# EasyEDA schematic dev_kit.json
TITLE: Sheet_1; REV: 1.0; Date: 2024-11-02; Sheet: 1/1; Company: Your Company
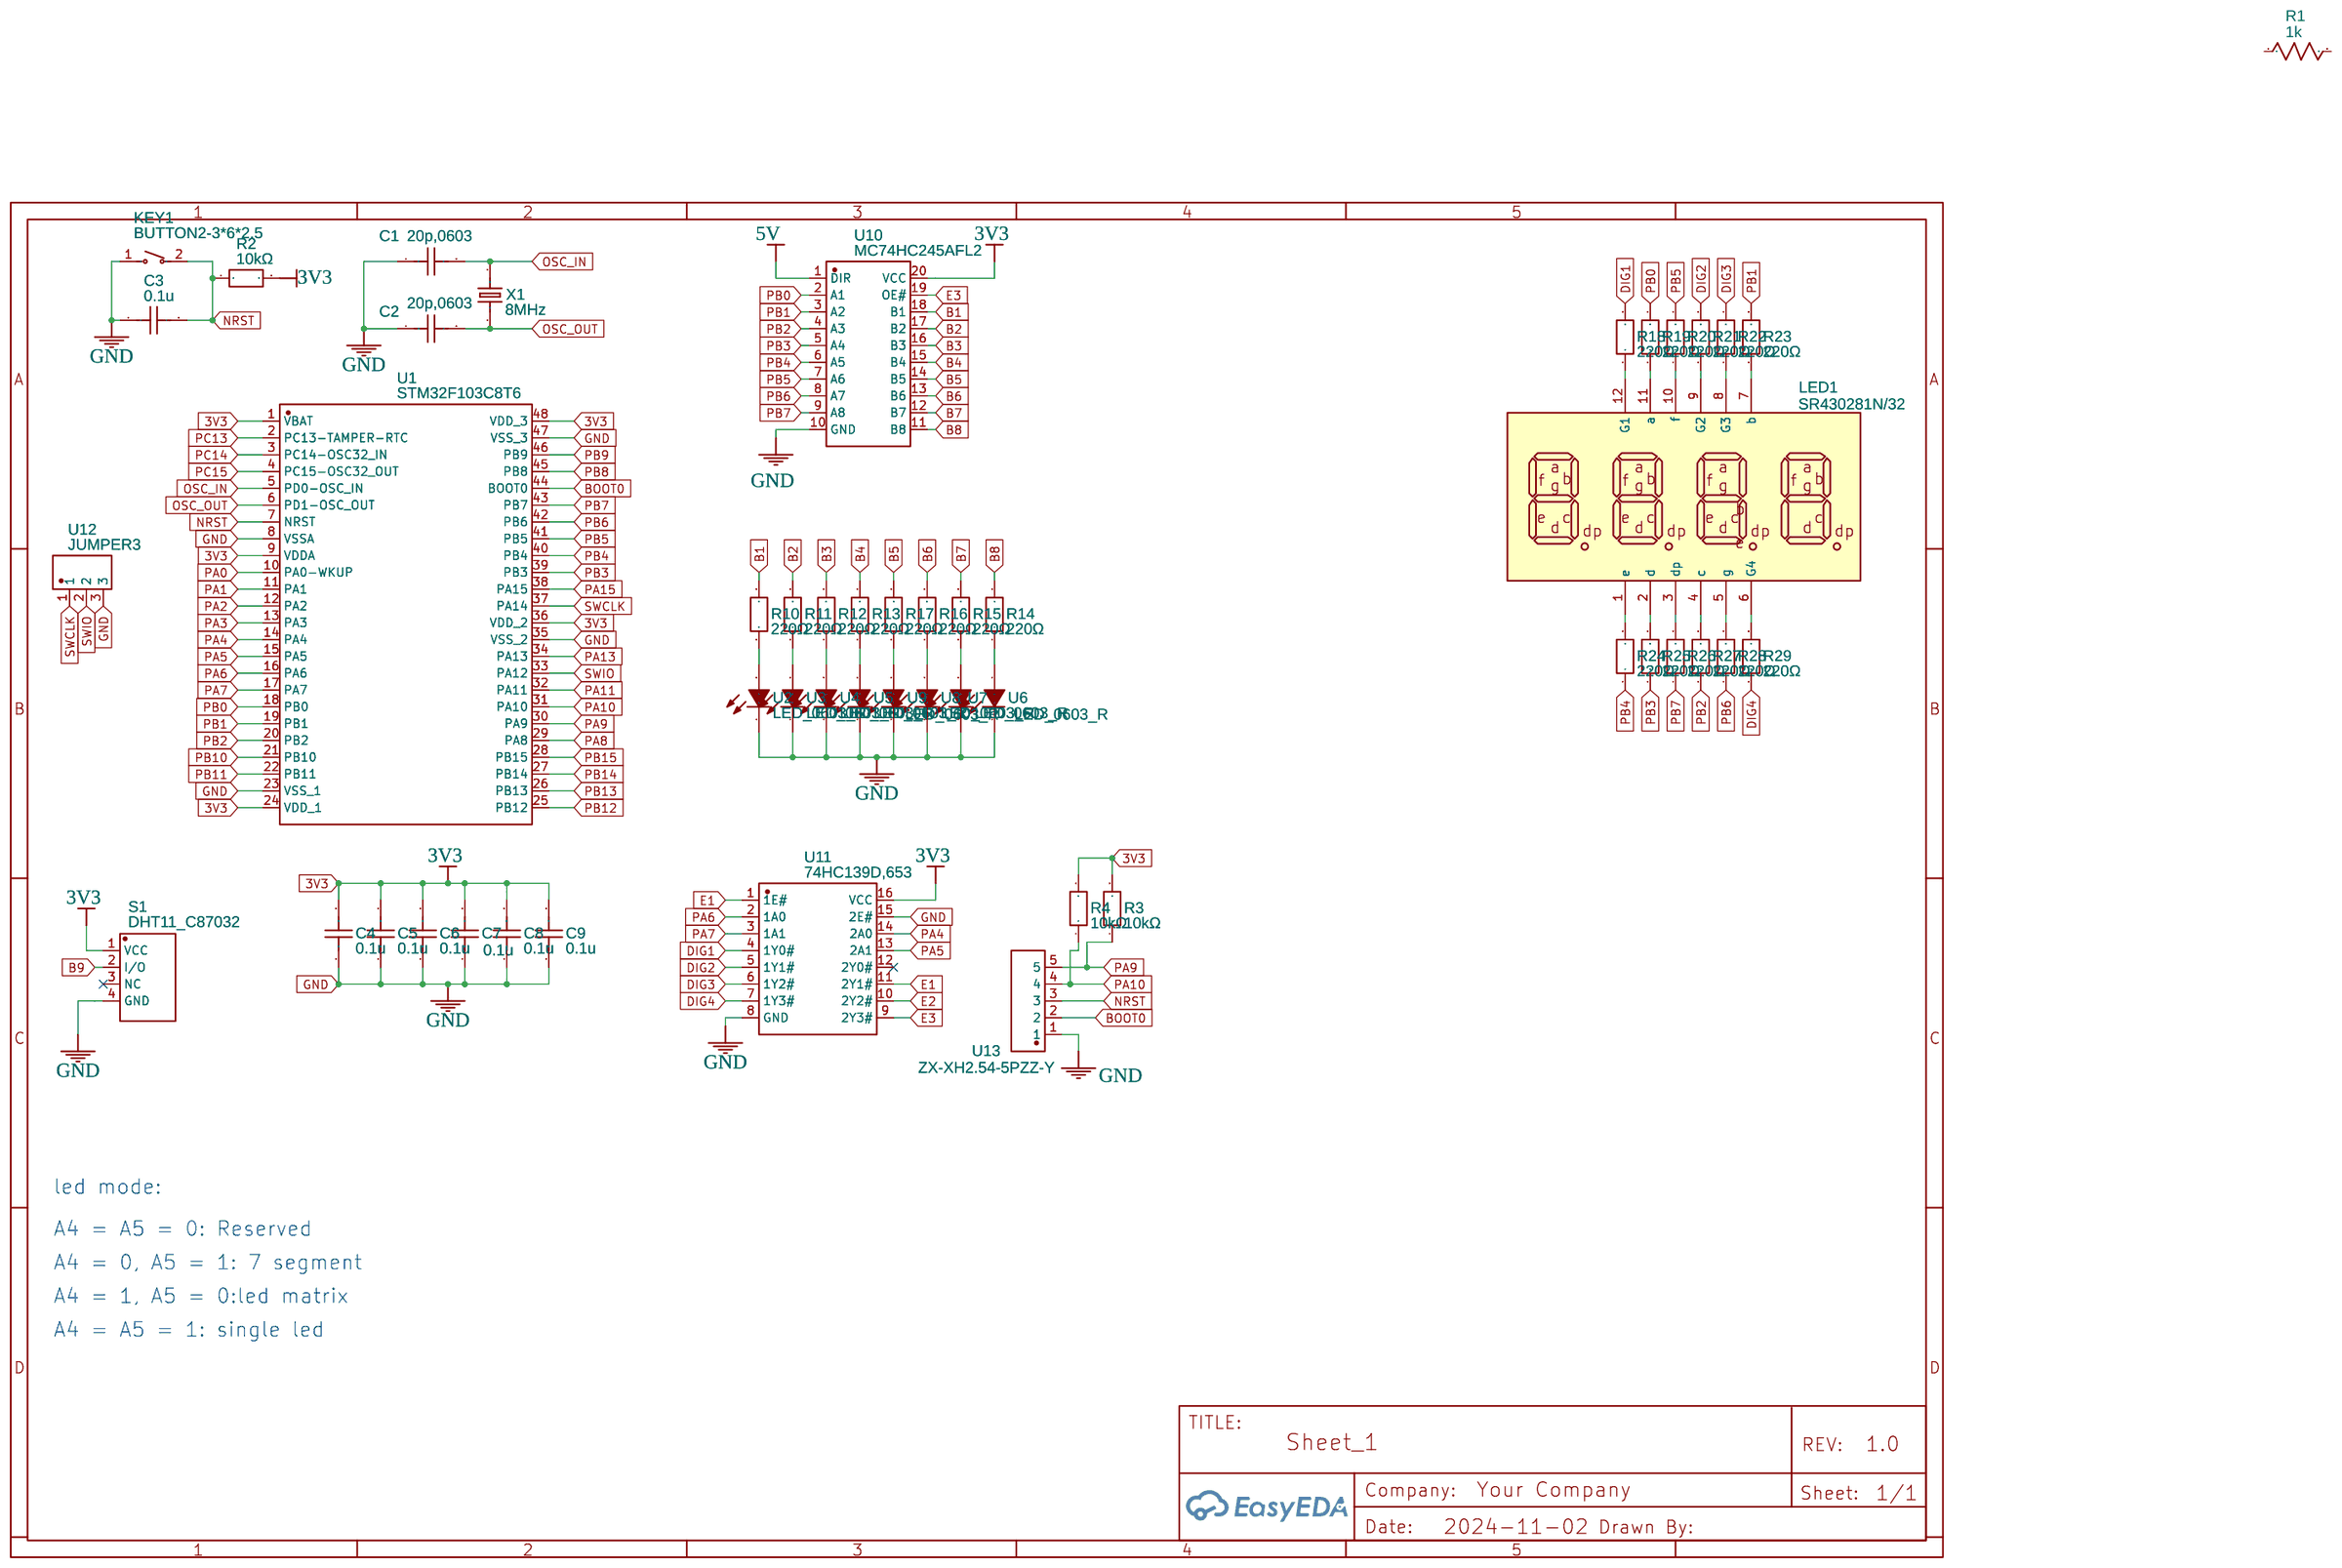
[diagram p0: schematic sheet]

## Parts
C1  20p,0603  [C0603]
C2  20p,0603  [C0603]
C3  0.1u  [C0603]
C4  0.1u  [C0603]
C5  0.1u  [C0603]
C6  0.1u  [C0603]
C7  0.1u  [C0603]
C8  0.1u  [C0603]
C9  0.1u  [C0603]
KEY1  BUTTON2-3*6*2.5  [SW-SMD_L6.0-W3.7-LS8.0]
LED1  SR430281N/32  [LED-SEG-TH_12P-L32.1-W10.0-P2.54-S7.62-BL]
R1  1k  [R0603]
R2  10kΩ  [R0603]
R3  10kΩ  [R0603]
R4  10kΩ  [R0603]
R10  220Ω  [R0603]
R11  220Ω  [R0603]
R12  220Ω  [R0603]
R13  220Ω  [R0603]
R14  220Ω  [R0603]
R15  220Ω  [R0603]
R16  220Ω  [R0603]
R17  220Ω  [R0603]
R18  220Ω  [R0603]
R19  220Ω  [R0603]
R20  220Ω  [R0603]
R21  220Ω  [R0603]
R22  220Ω  [R0603]
R23  220Ω  [R0603]
R24  220Ω  [R0603]
R25  220Ω  [R0603]
R26  220Ω  [R0603]
R27  220Ω  [R0603]
R28  220Ω  [R0603]
R29  220Ω  [R0603]
S1  DHT11_C87032  [SENSOR-TH_DHT11-1]
U1  STM32F103C8T6  [LQFP-48_L7.0-W7.0-P0.50-LS9.0-BL]
U2  LED_0603_R  [LED0603-RD]
U3  LED_0603_R  [LED0603-RD]
U4  LED_0603_R  [LED0603-RD]
U5  LED_0603_R  [LED0603-RD]
U6  LED_0603_R  [LED0603-RD]
U7  LED_0603_R  [LED0603-RD]
U8  LED_0603_R  [LED0603-RD]
U9  LED_0603_R  [LED0603-RD]
U10  MC74HC245AFL2  [SOIC-20_L12.6-W5.3-P1.27-LS7.8-BL]
U11  74HC139D,653  [SOIC-16_L9.9-W3.9-P1.27-LS6.0-BL]
U12  JUMPER3  [HDR-TH_3P-P2.54-V-M-A]
U13  ZX-XH2.54-5PZZ-Y  [CONN-TH_5P-P2.54_ZX-XH2.54-5PZZ-Y]
X1  8MHz  [HC-49US_L11.5-W4.5-P4.88]

## Library data of the parts
C1-C9 = C_0603_US: Contributor: LCEDA_Lib
KEY1 = BUTTON2-3*6*2.5: Contributor: LCSC; Supplier: LCSC; Supplier Part: C9900009018; Manufacturer: null; JLCPCB Part Class: Extended Part
LED1 = SR430281N/32: Contributor: LCSC; Supplier: LCSC; Supplier Part: C252225; Manufacturer: ARKLED(方舟); JLCPCB Part Class: Extended Part
R1 = R_0603_US: Contributor: LCEDA_Lib
R2-R4 = TD03E1002BT: Contributor: lcsc; Supplier: LCSC; Supplier Part: C2991686; Manufacturer: FH(风华); JLCPCB Part Class: Extended Part
R10-R29 = CRCW0603220RFKEA: Contributor: LCSC; Supplier: LCSC; Supplier Part: C844757; Manufacturer: VISHAY(威世); JLCPCB Part Class: Extended Part
S1 = DHT11_C87032: Supplier Part: C87032; Supplier: LCSC; Manufacturer: AOSONG; Manufacturer Part: DHT11; JLCPCB Part Class: Extended Part
U1 = STM32F103C8T6: Supplier: LCSC; Manufacturer: ST(意法半导体); Supplier Part: C8734; JLCPCB Part Class: Extended Part
U2-U9 = LED_0603_R: Contributor: lcsc; Supplier: LCSC; Supplier Part: C9900016084; Manufacturer: null; JLCPCB Part Class: Extended Part
U10 = MC74HC245AFL2: Contributor: lcsc; Supplier: LCSC; Supplier Part: C3587560; Manufacturer: MOTOROLA(摩托罗拉)
U11 = 74HC139D,653: Supplier: LCSC; Manufacturer: Nexperia(安世); Supplier Part: C5603; JLCPCB Part Class: Extended Part
U12 = JUMPER3: Contributor: LCSC; Supplier: LCSC; Supplier Part: C2940050; Manufacturer: null; Manufacturer Part: Jumper3; JLCPCB Part Class: Extended Part
U13 = ZX-XH2.54-5PZZ-Y: Supplier: LCSC; Supplier Part: C22388687; Manufacturer: Megastar(兆星); Contributor: lcsc; JLCPCB Part Class: Extended Part
X1 = 49S-8.00-20-10-10/A: Contributor: LCSC; Supplier: LCSC; Supplier Part: C240953; Manufacturer: LIMING(利明); JLCPCB Part Class: Extended Part

## Nets
3V3: C4.2 C5.2 C6.2 C7.2 C8.2 C9.2 R2.2 R3.2 R4.2 S1.1(VCC) U1.1(VBAT) U1.9(VDDA) U1.24(VDD_1) U1.36(VDD_2) U1.48(VDD_3) U10.20(VCC) U11.16(VCC)
5V: U10.1(DIR)
GND: C1.1 C2.1 C3.1 C4.1 C5.1 C6.1 C7.1 C8.1 C9.1 KEY1.1 S1.4(GND) U1.8(VSSA) U1.23(VSS_1) U1.35(VSS_2) U1.47(VSS_3) U2.1(-) U3.1(-) U4.1(-) U5.1(-) U6.1(-) U7.1(-) U8.1(-) U9.1(-) U10.10(GND) U11.8(GND) U11.15(2E#) U12.3 U13.1
B1: R10.2 U10.18(B1)
B2: R11.2 U10.17(B2)
B3: R12.2 U10.16(B3)
B4: R13.2 U10.15(B4)
B5: R17.2 U10.14(B5)
B6: R16.2 U10.13(B6)
B7: R15.2 U10.12(B7)
B8: R14.2 U10.11(B8)
B9: S1.2(I/O)
BOOT0: U1.44(BOOT0) U13.2
DIG1: R18.2 U11.4(1Y0#)
DIG2: R21.2 U11.5(1Y1#)
DIG3: R22.2 U11.6(1Y2#)
DIG4: R29.1 U11.7(1Y3#)
E1: U11.1(1E#) U11.11(2Y1#)
E2: U11.10(2Y2#)
E3: U10.19(OE#) U11.9(2Y3#)
NRST: C3.2 KEY1.2 R2.1 U1.7(NRST) U13.3
OSC_IN: C1.2 U1.5(PD0-OSC_IN) X1.2
OSC_OUT: C2.2 U1.6(PD1-OSC_OUT) X1.1
PA0: U1.10(PA0-WKUP)
PA1: U1.11(PA1)
PA2: U1.12(PA2)
PA3: U1.13(PA3)
PA4: U1.14(PA4) U11.14(2A0)
PA5: U1.15(PA5) U11.13(2A1)
PA6: U1.16(PA6) U11.2(1A0)
PA7: U1.17(PA7) U11.3(1A1)
PA8: U1.29(PA8)
PA9: R3.1 U1.30(PA9) U13.5
PA10: R4.1 U1.31(PA10) U13.4
PA11: U1.32(PA11)
PA13: U1.34(PA13)
PA15: U1.38(PA15)
PB0: R19.2 U1.18(PB0) U10.2(A1)
PB1: R23.2 U1.19(PB1) U10.3(A2)
PB2: R27.1 U1.20(PB2) U10.4(A3)
PB3: R25.1 U1.39(PB3) U10.5(A4)
PB4: R24.1 U1.40(PB4) U10.6(A5)
PB5: R20.2 U1.41(PB5) U10.7(A6)
PB6: R28.1 U1.42(PB6) U10.8(A7)
PB7: R26.1 U1.43(PB7) U10.9(A8)
PB8: U1.45(PB8)
PB9: U1.46(PB9)
PB10: U1.21(PB10)
PB11: U1.22(PB11)
PB12: U1.25(PB12)
PB13: U1.26(PB13)
PB14: U1.27(PB14)
PB15: U1.28(PB15)
PC13: U1.2(PC13-TAMPER-RTC)
PC14: U1.3(PC14-OSC32_IN)
PC15: U1.4(PC15-OSC32_OUT)
SWCLK: U1.37(PA14) U12.1
SWIO: U1.33(PA12) U12.2
Net-(LED1-1): LED1.1(e) R24.2
Net-(LED1-2): LED1.2(d) R25.2
Net-(LED1-3): LED1.3(dp) R26.2
Net-(LED1-4): LED1.4(c) R27.2
Net-(LED1-5): LED1.5(g) R28.2
Net-(LED1-6): LED1.6(G4) R29.2
Net-(LED1-7): LED1.7(b) R23.1
Net-(LED1-8): LED1.8(G3) R22.1
Net-(LED1-9): LED1.9(G2) R21.1
Net-(LED1-10): LED1.10(f) R20.1
Net-(LED1-11): LED1.11(a) R19.1
Net-(LED1-12): LED1.12(G1) R18.1
Net-(R10-1): R10.1 U2.2(+)
Net-(R11-1): R11.1 U3.2(+)
Net-(R12-1): R12.1 U4.2(+)
Net-(R13-1): R13.1 U5.2(+)
Net-(R14-1): R14.1 U6.2(+)
Net-(R15-1): R15.1 U7.2(+)
Net-(R16-1): R16.1 U8.2(+)
Net-(R17-1): R17.1 U9.2(+)

Not connected (* = marked no-connect by the designer): R1 1 2; S1 3(NC)*; U11 12(2Y0#)*

## Notes on the sheet
- led mode:
- A4 = A5 = 0: Reserved
- A4 = 0, A5 = 1: 7 segment
- A4 = 1, A5 = 0:led matrix
- A4 = A5 = 1: single led
